# EAGLE design relay-unit (EAGLE 6.5.0)
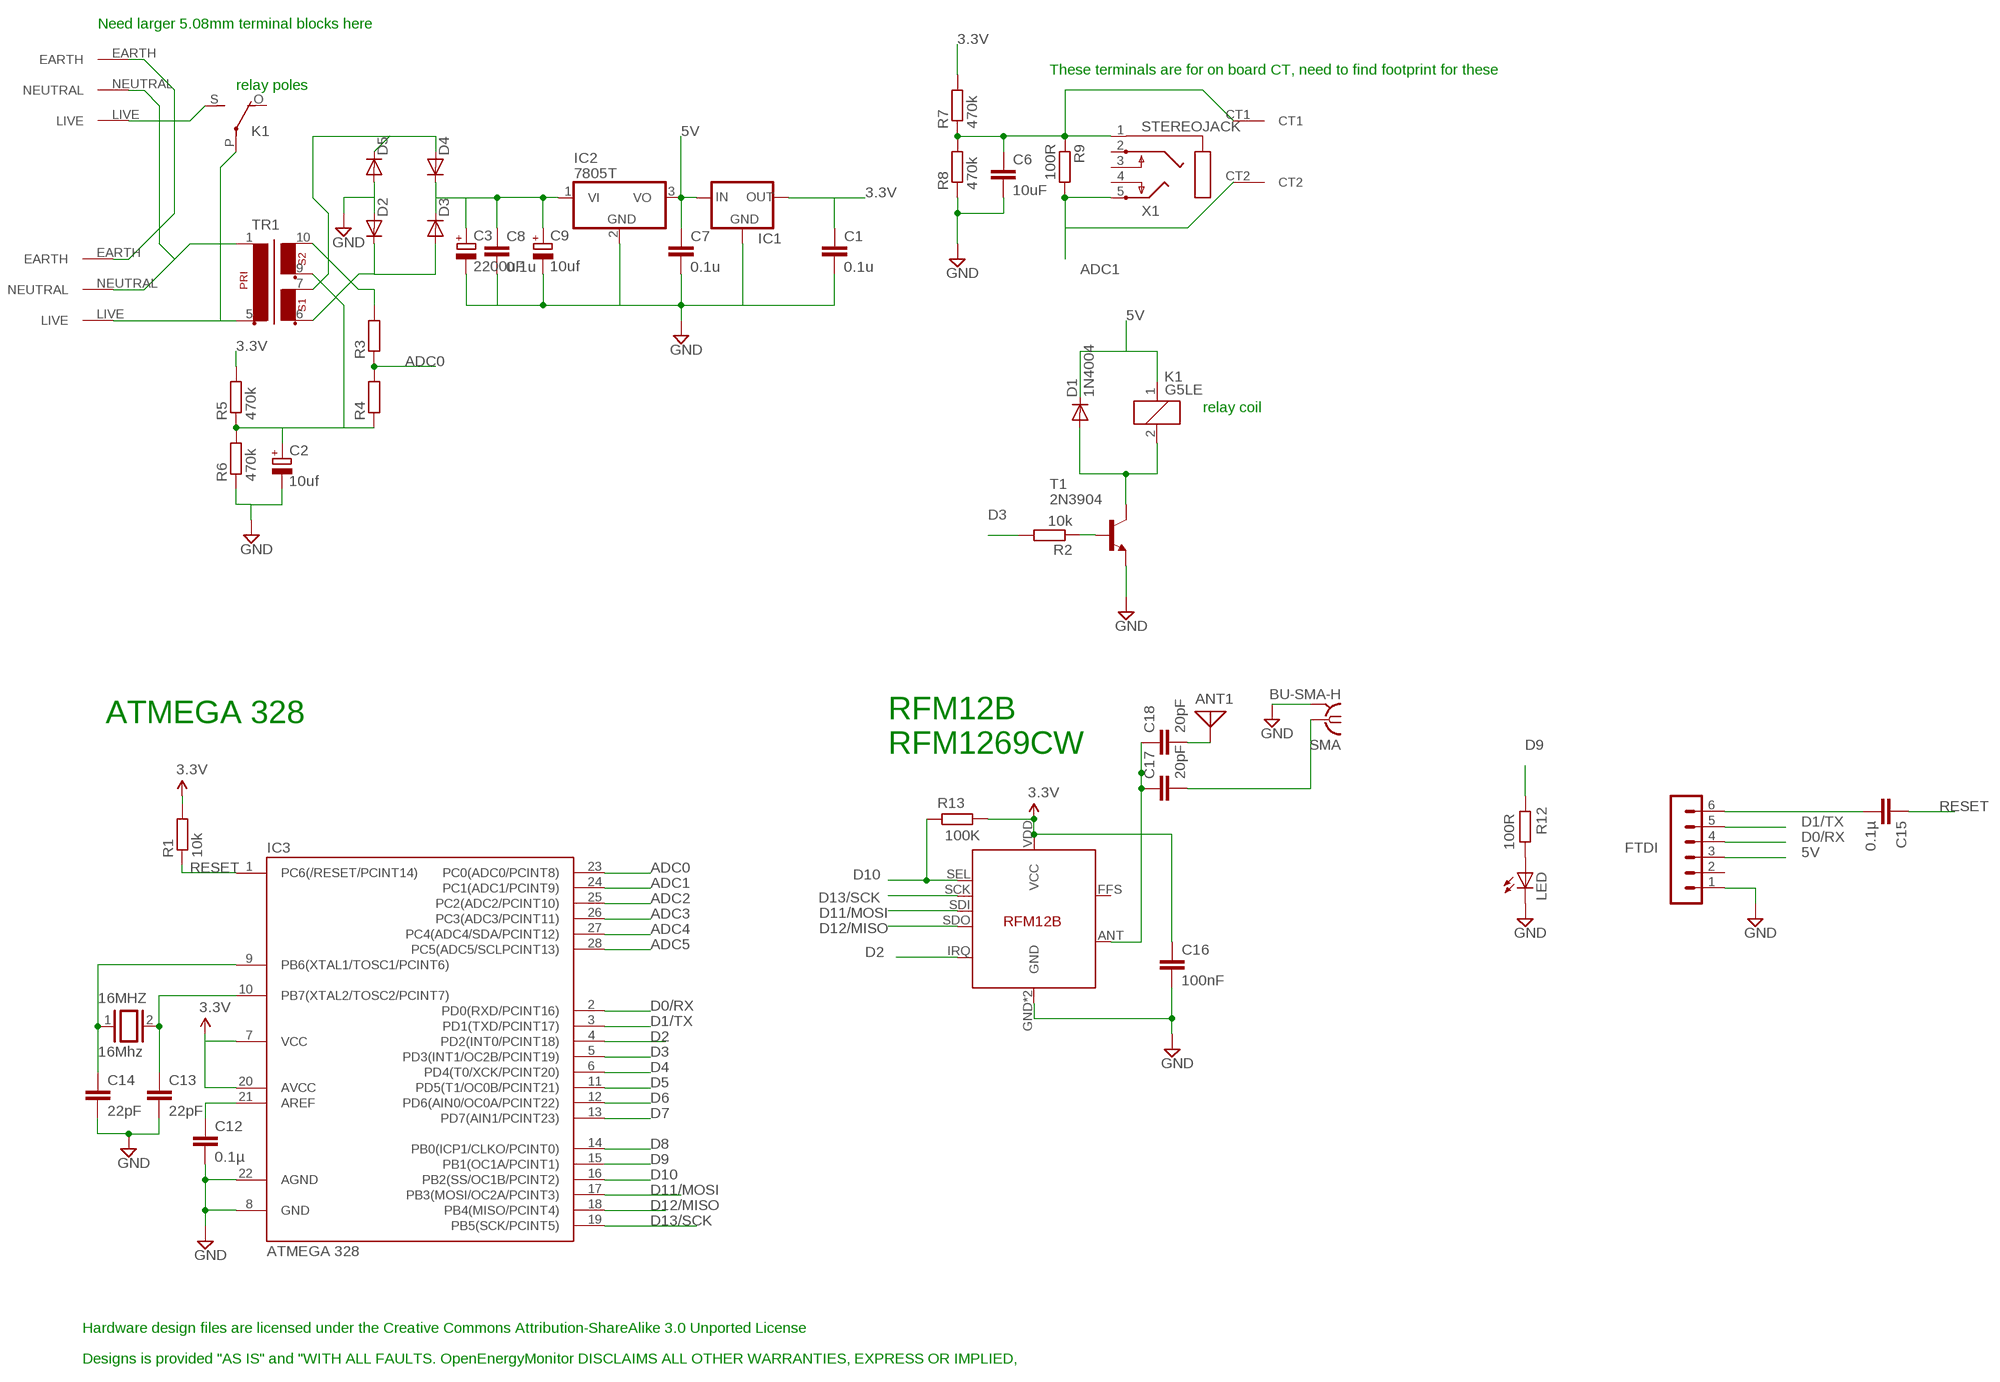
[diagram p0: schematic, sheet 1]

## Parts
16MHZ  16Mhz  XTAL/S  [QS]
ANT1  ANTENNA  [PAD-01]
C1  0.1u  C-EU025-024X044  [C025-024X044]
C2  10uf  CPOL-EUE1.8-4  [E1,8-4]
C3  2200uF  CPOL-EUE5-13  [E5-13]
C6  10uF  C-EU025-024X044  [C025-024X044]
C7  0.1u  C-EU025-024X044  [C025-024X044]
C8  0.1u  C-EU025-024X044  [C025-024X044]
C9  10uf  CPOL-EUE1.8-4  [E1,8-4]
C12  0.1µ  C-EU025-024X044  [C025-024X044]
C13  22pF  C2.5/2  [C2.5-2]
C14  22pF  C2.5/2  [C2.5-2]
C15  0.1µ  C-EU025-024X044  [C025-024X044]
C16  100nF  C-EU025-024X044  [C025-024X044]
C17  20pF  C-EU025-024X044  [C025-024X044]
C18  20pF  C-EU025-024X044  [C025-024X044]
D1  1N4004  [DO41-10]
D2  1N4004  [DO41-10]
D3  1N4004  [DO41-10]
D4  1N4004  [DO41-10]
D5  1N4004  [DO41-10]
FTDI  FTDI  MA06-1  [MA06-1]
IC1  MCP1700TRI  [TO92]
IC2  7805T  [TO220H]
IC3  ATMEGA 328  ATMEGA48/88/168-PU  [DIL28-3]
K1  G5LE  [G5LE]
LED  LED3MM  [LED3MM]
R1  10k  R-EU_0204/7  [0204/7]
R2  10k  R-EU_0204/7  [0204/7]
R3  R-EU_0204/7  [0204/7]
R4  R-EU_0204/7  [0204/7]
R5  470k  R-EU_0204/7  [0204/7]
R6  470k  R-EU_0204/7  [0204/7]
R7  470k  R-EU_0204/7  [0204/7]
R8  470k  R-EU_0204/7  [0204/7]
R9  100R  R-EU_0204/7  [0204/7]
R12  100R  R-EU_0204/7  [0204/7]
R13  100K  R-EU_0204/7  [0204/7]
SMA  BU-SMA-H  [BU-SMA-H]
T1  2N3904  [TO92]
TR1  EI30-2  [EI30-2]
U$1  TESTTEST  [TEST]
U$2  AC_IN  [AC_IN]
U$3  CT  [CT]
U$14  RFM12B  [RFM12B]
X1  STEREOJACK  [STX3100]

## Nets
3.3V: C1.1 C16.1 IC1.3(OUT) IC3.7(VCC) IC3.20(AVCC) R1.2 R5.2 R7.2 R13.1 U$14.VDD(VCC)
5V: C7.1 D1.C FTDI.3 IC1.2(IN) IC2.3(VO) K1.1
ADC0: IC3.23(PC0(ADC0/PCINT8)) R3.1 R4.2
ADC1: IC3.24(PC1(ADC1/PCINT9)) R9.2 U$3.CT2 X1.5
ADC2: IC3.25(PC2(ADC2/PCINT10))
ADC3: IC3.26(PC3(ADC3/PCINT11))
ADC4: IC3.27(PC4(ADC4/SDA/PCINT12))
ADC5: IC3.28(PC5(ADC5/SCLPCINT13))
D0/RX: FTDI.4 IC3.2(PD0(RXD/PCINT16))
D1/TX: FTDI.5 IC3.3(PD1(TXD/PCINT17))
D2: IC3.4(PD2(INT0/PCINT18)) U$14.IRQ
D3: IC3.5(PD3(INT1/OC2B/PCINT19)) R2.2
D4: IC3.6(PD4(T0/XCK/PCINT20))
D5: IC3.11(PD5(T1/OC0B/PCINT21))
D6: IC3.12(PD6(AIN0/OC0A/PCINT22))
D7: IC3.13(PD7(AIN1/PCINT23))
D8: IC3.14(PB0(ICP1/CLKO/PCINT0))
D9: IC3.15(PB1(OC1A/PCINT1)) R12.2
D10: IC3.16(PB2(SS/OC1B/PCINT2)) R13.2 U$14.SEL
D11/MOSI: IC3.17(PB3(MOSI/OC2A/PCINT3)) U$14.SDI
D12/MISO: IC3.18(PB4(MISO/PCINT4)) U$14.SDO
D13/SCK: IC3.19(PB5(SCK/PCINT5)) U$14.SCK
DIG1: C17.1 C18.1 U$14.ANT
GND: C1.2 C2.- C3.- C6.2 C7.2 C8.2 C9.- C12.2 C13.2 C14.2 C16.2 D2.A D5.A FTDI.1 IC1.1(GND) IC2.2(GND) IC3.8(GND) IC3.22(AGND) LED.K(C) R6.1 R8.1 SMA.2 SMA.3 SMA.4 SMA.5 T1.3(E) U$14.GND U$14.P$12(GND)
N$1: C12.1 IC3.21(AREF)
N$2: 16MHZ.2 C13.1 IC3.10(PB7(XTAL2/TOSC2/PCINT7))
N$4: C15.2 FTDI.6
N$8: LED.A R12.1
N$11: ANT1.1 C18.2
N$12: 16MHZ.1 C14.1 IC3.9(PB6(XTAL1/TOSC1/PCINT6))
N$13: C3.+ C8.1 C9.+ D3.C D4.C IC2.1(VI)
N$14: R3.2 TR1.10
N$15: R2.1 T1.2(B)
N$16: D1.A K1.2 T1.1(C)
N$19: K1.S(2:S) U$1.LIVE
N$20: TR1.1 U$1.NEUTRAL U$2.NEUTRAL
N$21: C2.+ R4.1 R5.1 R6.2 TR1.9
N$22: D2.C D3.A TR1.6
N$24: C17.2 SMA.1
N$26: C6.1 R7.1 R8.2 R9.1 U$3.CT1 X1.1
N$28: D4.A D5.C TR1.7
N$36: U$1.EARTH U$2.EARTH
N$40: K1.P(2:P) TR1.5 U$2.LIVE
RESET: C15.1 IC3.1(PC6(/RESET/PCINT14)) R1.1
Unconnected: FTDI.2 K1.O(2:O) U$14.FFS X1.2 X1.3 X1.4

## Notes on the sheet
- Need larger 5.08mm terminal blocks here
- These terminals are for on board CT, need to find footprint for these
- relay poles
- relay coil
- ATMEGA 328
- RFM12B
  RFM1269CW
- Hardware design files are licensed under the Creative Commons Attribution-ShareAlike 3.0 Unported License
- Designs is provided "AS IS" and "WITH ALL FAULTS. OpenEnergyMonitor DISCLAIMS ALL OTHER WARRANTIES, EXPRESS OR IMPLIED,

## Library data of the parts
16MHZ = special:XTAL/S: CRYSTAL
ANT1 = discrete:ANTENNA: Antenna
C1 C6-C8 C12 C15-C18 = resistor:C-EU: CAPACITOR, European symbol
C2 C3 C9 = rcl:CPOL-EU: POLARIZED CAPACITOR, European symbol
C13 C14 = capacitor-wima:C: CAPACITOR naming: grid - package width
D1-D5 = adafruit:1N4004: DIODE General purpose 1N400x type rectifier (With bigger pads) http://www.ladyada.net/library/pcb/eaglelibrary.html
FTDI = JeeLabs:MA06-1: PIN HEADER
IC1 = adafruit:MCP1700: VOLTAGE REGULATOR
IC2 = adafruit:78*: Positive VOLTAGE REGULATOR Added bigger pads to the TO-92 package
IC3 = atmega8:ATMEGA48/88/168-PU
K1 = relay:G5LE: RELAY 1 x switch, 10 A/120 V AC, 8 A/30 V DC, Omron; OC_FARNELL: unknown; OC_NEWARK: unknown
LED = adafruit:LED: LED OSRAM: - CHIPLED LG R971, LG N971, LY N971, LG Q971, LY Q971, LO R971, LY R971 LH N974, LH R974 LS Q976, LO Q976, LY Q976 LO Q996 - Hyper CHIPLED LW Q18S LB Q993, LB Q99A, LB R99A - SideLED LS A670, LO A670, LY A670, LG A670, LP A670 LB A673, LV A673, LT A673, LW A673 LH A674 LY A675 LS A676, LA A676, LO A676, LY A676, LW A676 LS A679, LY A679, LG A679 - Hyper Micro SIDELED® LS Y876, LA Y876, LO Y876, LY Y876 LT Y87S - SmartLED LW L88C, LW L88S LB L89C, LB L89S, LG L890 LS L89K, LO L89K, LY L89K LS L896, LA L896, LO L896, LY L896 - TOPLED LS T670, LO T670, LY T670, LG T670, LP T670 LSG T670, LSP T670, LSY T670, LOP T670, LYG T670 LG T671, LOG T671, LSG T671 LB T673, LV T673, LT T673, LW T673 LH T674 LS T676, LA T676, LO T676, LY T676, LB T676, LH T676, LSB T676, LW T676 LB T67C, LV T67C, LT T67C, LS T67K, LO T67K, LY T67K, LW E67C LS E67B, LA E67B, LO E67B, LY E67B, LB E67C, LV E67C, LT E67C LW T67C LS T679, LY T679, LG T679 LS T770, LO T770, LY T770, LG T770, LP T770 LB T773, LV T773, LT T773, LW T773 LH T774 LS E675, LA E675, LY E675, LS T675 LS T776, LA T776, LO T776, LY T776, LB T776 LHGB T686 LT T68C, LB T68C - Hyper Mini TOPLED® LB M676 - Mini TOPLED Santana® LG M470 LS M47K, LO M47K, LY M47K Source: http://www.osram.convergy.de/
R1 = resistor:R-EU_: RESISTOR, European symbol
R2-R9 R12 R13 = rcl:R-EU_: RESISTOR, European symbol
SMA = con-coax:BU-SMA-H: FEMALE SMA CONNECTOR Radiall; OC_FARNELL: unknown; OC_NEWARK: unknown
T1 = transistor:2N3904: NPN TRANSISTOR
TR1 = trafo:EI30-2: TRANSFORMER 1 primary winding, 2 secondary windings ERA
U$1 = trystan:TEST
U$2 = trystan:AC_IN
U$3 = trystan:CT
U$14 = JeeParts:RFM12B
X1 = adafruit:STEREOJACK: MIC/HEADPHONE JACK Stereo jack with two switches. Kycon STX3100, CUI SJ1-3555NG and/or 4UCon 05544

## Net classes
0 default: width 0.203 mm, drill 0.6 mm, clearance 0.203 mm
1 power: width 0.381 mm, drill 0.6 mm, clearance 0.254 mm

## Board
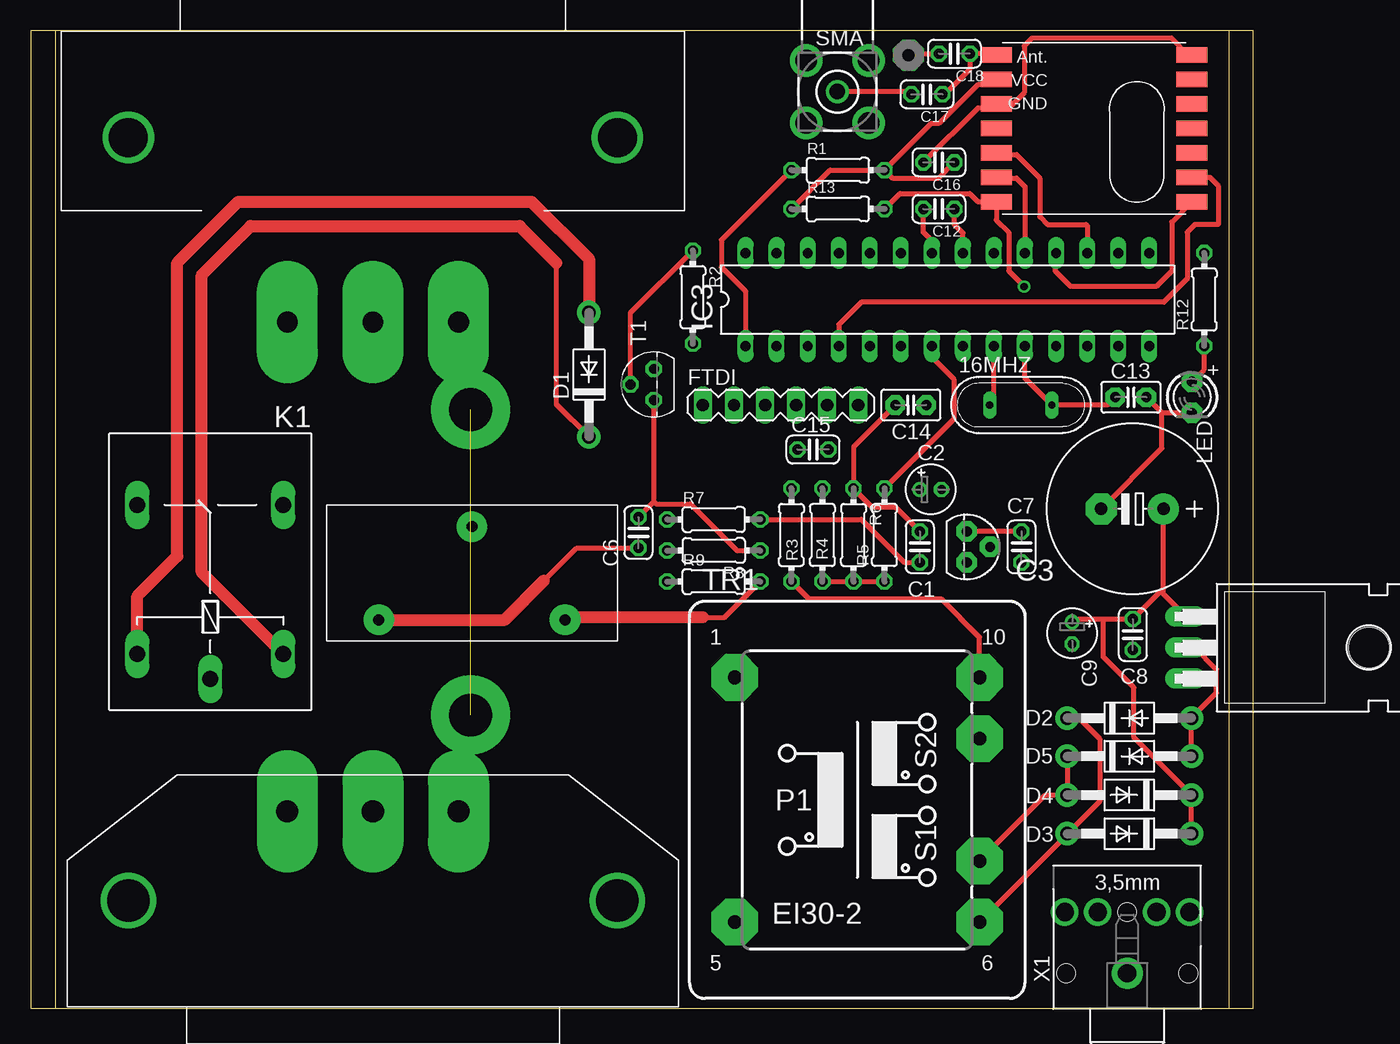
[diagram p1: board, top side]
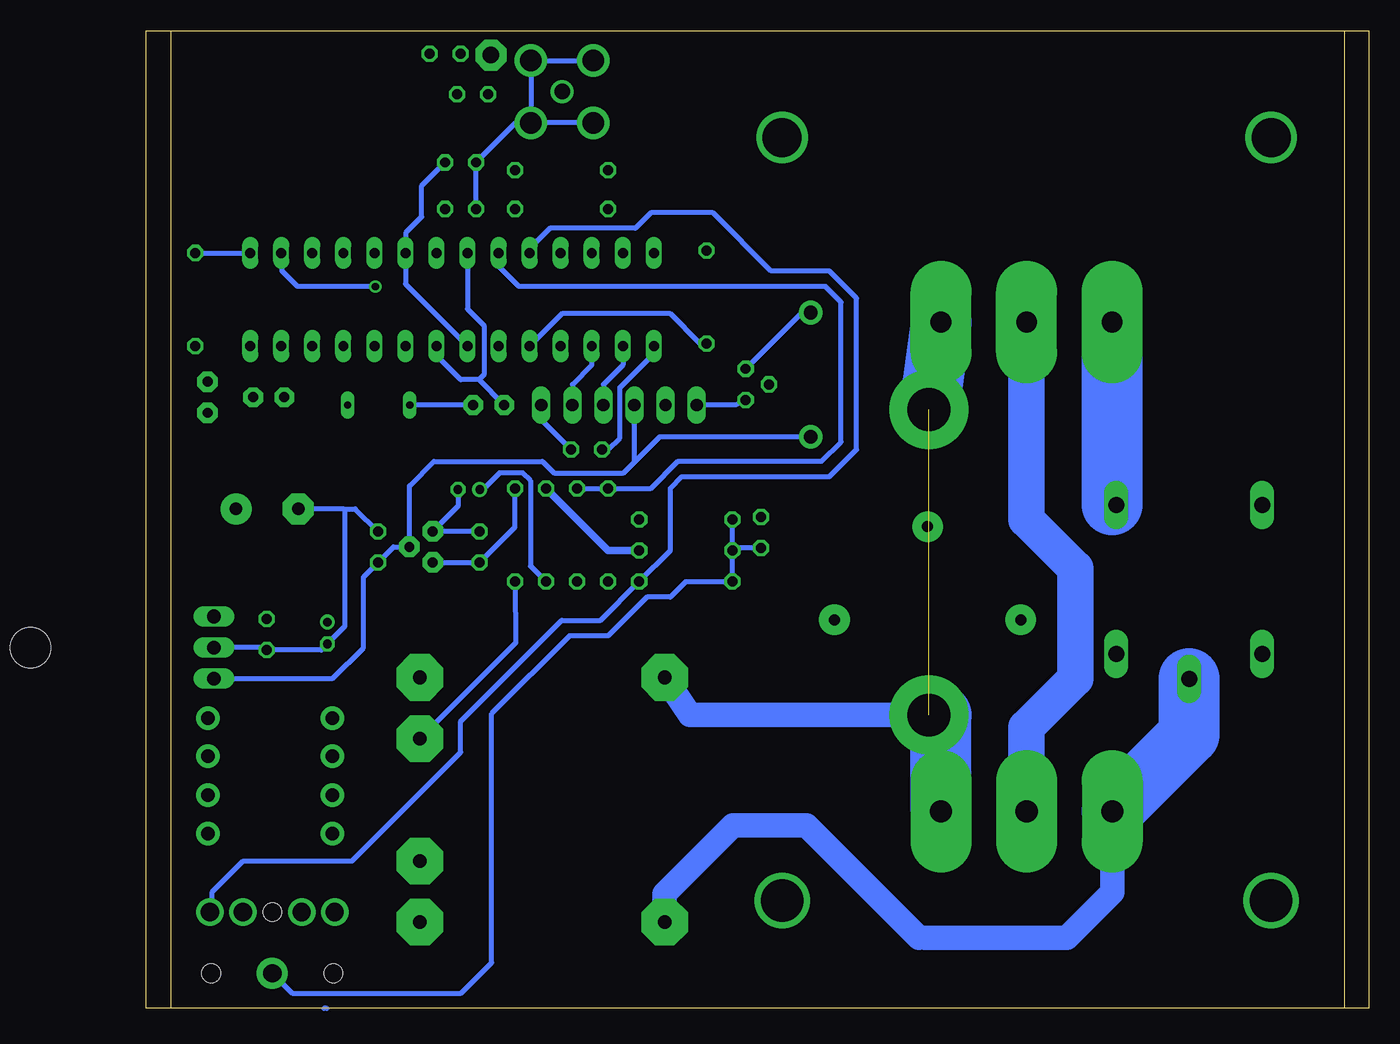
[diagram p2: board, bottom side, seen from below]

Size 100 x 80 mm. Coordinates in mm from the lower left corner, seen from the top.
Outline: 2,0 0,0 0,80 2,80
Outline: 2,0 98,0
Outline: 98,0 100,0 100,80 98,80
Outline: 98,80 2,80
Outline: 2,80 2,0
Outline: 98,80 98,0
Copper layers (1*16): Top 0.035mm / dielectric 1.5mm / Bottom 0.035mm
Design rules "default": minimum track width 10mil, minimum drill 24mil, track to track 8mil, track to pad 8mil, pad to pad 8mil, via to via 8mil, smd to smd 8mil, copper to edge 40mil, drill to drill 8mil, minimum pad ring 10mil, minimum via ring 8mil, stop-mask expansion 4mil, vias tented up to drill 0mil, thermal gap 10mil

### Footprints (pad centres in the part's own frame; a part is rotated, then mirrored left to right if it is on the bottom)
QS = drill 0.61 long: 1 -2.54,0; 2 2.54,0
PAD-01 = drill 1.321 pad 2.54 octagon: 1 0,0
C025-024X044 = drill 0.813 octagon: 1 -1.27,0; 2 1.27,0
E1,8-4 = drill 0.711 pad 1.168: + -0.889,0 | drill 0.711 pad 1.168 octagon: - 0.889,0
E5-13 = drill 1.016 pad 2.54: + -2.54,0 | drill 1.016 pad 2.54 octagon: - 2.54,0
C2.5-2 = drill 0.813 pad 1.6 octagon: 1 -1.27,0; 2 1.27,0
DO41-10 = drill 1.118 pad 1.93: A 5.08,0; C -5.08,0
MA06-1 = drill 1.016 long: 1 0,0; 2 2.54,0; 3 5.08,0; 4 7.62,0; 5 10.16,0; 6 12.7,0
TO92 = drill 0.813 pad 1.676 octagon: 1 -1.27,0; 2 0,1.905; 3 1.27,0
TO220H = drill 1.118 long: 1 -2.54,-10.16; 2 0,-10.16; 3 2.54,-10.16 | hole 3.302: 0,4.826
DIL28-3 = drill 0.813 long: 1 -16.51,-3.81; 2 -13.97,-3.81; 3 -11.43,-3.81; 4 -8.89,-3.81; 5 -6.35,-3.81; 6 -3.81,-3.81; 7 -1.27,-3.81; 8 1.27,-3.81; 9 3.81,-3.81; 10 6.35,-3.81; 11 8.89,-3.81; 12 11.43,-3.81; 13 13.97,-3.81; 14 16.51,-3.81; 15 16.51,3.81; 16 13.97,3.81; 17 11.43,3.81; 18 8.89,3.81; 19 6.35,3.81; 20 3.81,3.81; 21 1.27,3.81; 22 -1.27,3.81; 23 -3.81,3.81; 24 -6.35,3.81; 25 -8.89,3.81; 26 -11.43,3.81; 27 -13.97,3.81; 28 -16.51,3.81
G5LE = drill 1.321 long: 1 -7.493,-5.969; 2 -7.493,5.969; O 4.699,5.969; P -9.525,0; S 4.699,-5.969
LED3MM = drill 0.813 pad 1.676 octagon: A -1.27,0; K 1.27,0
0204/7 = drill 0.813 octagon: 1 -3.81,0; 2 3.81,0
BU-SMA-H = drill 1.27: 1 0,0 | drill 1.778: 2 -2.55,2.55; 3 2.55,2.55; 4 2.55,-2.55; 5 -2.55,-2.55
TO92' = drill 0.813 octagon: 1 1.27,0; 2 0,1.905; 3 -1.27,0
EI30-2 = drill 1.118 pad 3.81 octagon: 1 -10.008,10.008; 5 -10.008,-10.008; 6 10.008,-10.008; 7 10.008,-5.004; 9 10.008,5.004; 10 10.008,10.008
TEST = drill 1.7 pad 5 long: EARTH 0,-15.1; LIVE -7,-15.1; NEUTRAL 7,-15.1 | drill 1.7 pad 3.5 octagon: LIVE1 -7,-15.1 | drill 3.2: P$4 -20,0; P$5 20,0
AC_IN = drill 1.8 pad 5 long: EARTH 0,0; LIVE 7,0; NEUTRAL -7,0 | drill 3.5: P$4 20,7.3; P$5 -20,7.3
CT = drill 0.9 pad 2.5: CT1 7.62,0; CT2 -7.62,0; P$3 0,-7.62
RFM12B = smd 2.54 x 1.27: ANT 8,-6; FFS -8,2; GND 8,-2; IRQ -8,4; P$8 -8,0; P$9 -8,-2; P$10 -8,-4; P$12 -8,-6; P$16 8,0; SCK 8,4; SDI 8,2; SDO -8,6; SEL 8,6; VDD 8,-4
STX3100 = drill 1.5 pad 2.54: 1 2.7,-0.1 | drill 1.5: 2 7.7,5; 3 7.7,2.3; 4 7.7,-2.5; 5 7.7,-5.2 | hole 1.5: 2.7,4.9; 2.7,-5.1; 7.7,-0.1

### Placement (x,y rotation side)
16MHZ  81,49.37 0 top
ANT1  71.83,78 0 top
C1  72.75,37.76 90 top
C2  73.62,42.46 0 top
C3  90.12,40.88 180 top
C6  49.73,38.94 90 top
C7  81.06,37.76 90 top
C8  90.16,30.59 270 top
C9  85.2,30.71 270 top
C12  74.3,65.41 180 top
C13  90,50 0 top
C14  72,49.37 180 top
C15  64,45.73 0 top
C16  74.3,69.22 180 top
C17  73.32,74.78 180 top
C18  75.56,78.11 180 top
D1  45.67,51.85 90 top
D2  89.88,23.75 0 top
D3  89.88,14.29 180 top
D4  89.88,17.46 180 top
D5  89.88,20.63 0 top
FTDI  55,49.37 0 top
IC1  76.58,37.76 270 top
IC2  104.65,29.52 270 top
IC3  75,58 0 top
K1  14.71,36.49 90 top
LED  95,50 270 top
R1  66.04,68.58 0 top
R2  54.17,58.2 270 top
R3  62.23,38.73 270 top
R4  64.77,38.73 90 top
R5  69.85,38.73 90 top
R6  67.31,38.73 270 top
R7  55.88,40.01 0 top
R8  55.88,37.47 180 top
R9  55.88,34.92 0 top
R12  96,58 90 top
R13  66.04,65.41 0 top
SMA  66,75 90 top
T1  2N3904  [TO92']  50.98,51.05 90 top
TR1  67.62,17.07 0 top
U$1  28,71.25 0 top
U$2  28,16.12 180 top
U$3  36.1,31.8 180 top
U$14  87,72 180 top
X1  89.6,0.18 90 top

### Tracks (layer width: path | path; a pad name or v marks a point on that pad's centre or on a via)
3.3V
  Top 0.406: R13.1 65.41,68.58 R1.2 | R1.2 70.48,67.94 74.3,67.94 C16.1 | U$14.VDD 78.56,75.56 77.47,75.56 74.3,72.39 73.66,72.39 R1.2 | R7.2 67.94,40.01 71.47,36.48 C1.1 | R5.2 75.56,48.26 75.56,51.44 73.73,53.27 IC3.7
  Bottom 0.406: IC1.3 C1.1 69.85,39.38 R5.2 | C16.1 77.47,67.31 77.47,64.77 78.74,63.5 78.74,61.88 IC3.20 78.81,59.27 IC3.7
5V
  Top 0.406: 43,61 43,49.45 D1.C
  Top 1: K1.1 14,35.67 14,60 18,64 40,64 43,61
  Bottom 0.406: IC2.3 94.47,27 84.75,27 82.25,29.5 82.25,35.3 C7.1 79.79,37.76 IC1.2 78.49,42.76 76.5,44.75 67.61,44.75 66.67,43.81 60.96,43.81 60.08,44.7 | 60.08,44.7 FTDI.3 | 60.08,44.7 58.01,46.77 D1.C
ADC0
  Bottom 0.406: R4.2 R3.1 58.74,42.55 56.52,44.77 44.77,44.77 43.18,46.35 43.18,57.78 44.45,59.05 69.53,59.05 71.19,60.71 IC3.23
ADC1
  Top 0.406: 43.92,32 U$3.CT2 | 55,32 56.77,32 R9.2
  Top 1: 55,32 43.92,32
  Bottom 0.406: X1.5 94.61,8.06 94.61,9.53 92.08,12.06 83.19,12.06 74.3,20.95 74.3,23.5 66.04,31.75 62.87,31.75 R9.2 57.15,37.47 57.15,42.55 56.2,43.5 44.13,43.5 41.91,45.72 41.91,58.1 44.13,60.33 48.9,60.33 53.66,65.09 58.74,65.09 60.01,63.82 66.99,63.82 68.65,62.16 IC3.24
D0/RX
  Bottom 0.406: IC3.2 61.03,52.63 62.62,51.05 FTDI.4
D1/TX
  Bottom 0.406: IC3.3 63.57,52.63 65.16,51.05 FTDI.5
D2
  Top 0.406: U$14.IRQ 96.47,68 97.16,67.31 97.16,64.14 95.25,64.14 94.61,63.5 94.61,59.69 92.71,57.78 67.94,57.78 66.11,55.95 IC3.4
D3
  Bottom 0.406: R2.2 54.7,54.39 57.15,56.83 66.01,56.83 IC3.5
D9
  Bottom 0.406: R12.2 IC3.15
D10  (via drill 0.6)
  Top 0.406: R13.2 71.12,66.67 76.83,66.67 77.51,66 U$14.SEL 79,64.51 80.01,63.5 80.01,60.33 v81.28,59.05
  Bottom 0.406: v81.28,59.05 87.63,59.05 88.9,60.33 88.9,61.74 IC3.16
D11/MOSI
  Top 0.406: U$14.SDI 79.15,69.85 80.64,69.85 82.55,67.94 82.55,64.77 83.19,64.14 86.36,64.14 86.43,64.06 IC3.17
D12/MISO
  Top 0.406: U$14.SDO 93.34,64.34 93.34,60.33 92.08,59.05 85.09,59.05 83.82,60.33 83.82,61.74 IC3.18
D13/SCK
  Top 0.406: U$14.SCK 79.06,67.94 80.64,67.94 81.35,67.24 IC3.19
DIG1
  Top 0.406: U$14.ANT 78,78 77.89,78.11 C18.1 76.83,76.83 74.78,74.78 C17.1
GND
  Top 0.406: D5.A D2.A 97,25.8 97,27.75 95.22,29.52 IC2.2 | C1.2 70.77,41 68.86,41 R6.1 67.31,45.95 C14.2 | IC3.22 73.73,62.8 73.03,63.5 C12.2 | U$14.P$12 94.72,78 93.34,79.38 81.92,79.38 81.28,78.74 81.28,74.93 80.01,73.66 79.34,73.66 U$14.GND 78.66,73.66 77.47,73.66 C16.2 | C13.2 92.54,48.73 | 92.54,48.73 LED.K | C3.- 92.54,45.83 92.54,48.73 | C6.2 50.98,41.46 | 50.98,41.46 T1.3 | 50.98,41.46 51.16,41.27 53.98,41.27 57.78,37.47 R8.1 | C7.2 IC1.1
  Bottom 0.406: IC2.2 90.36,29.52 C8.2 85.71,29.32 C9.- 83.75,31.28 83.75,40.75 83.88,40.88 | C1.2 IC1.1 | C2.- 74.51,41.1 IC1.1 | T1.3 51.83,49.37 FTDI.1 | 76.58,39.12 IC1.1 | C12.2 C16.2 69.79,72.45 SMA.5 | SMA.5 SMA.4 SMA.3 | SMA.2 SMA.5 | 83.88,40.88 C3.- | 83.88,40.88 82.91,40.88 C7.2 | C14.2 72.8,51.44 | 72.8,51.44 74.3,51.44 76.27,53.41 IC3.8 76.2,54.26 | IC3.22 73.73,57.22 72.39,55.88 72.39,51.84 72.8,51.44
  Bottom 0.61: R6.1 62.23,37.47 R8.1
N$1
  Top 0.406: IC3.21 76.27,63.43 75.56,64.14 C12.1
N$2
  Top 0.406: IC3.10 81.35,51.55 16MHZ.2 88.09,49.37 C13.1
N$4
  Bottom 0.406: C15.2 67.7,48.16 FTDI.6
N$8
  Top 0.406: LED.A 96,52.27 R12.1
N$11
  Top 0.406: ANT1.1 71.93,78.11 C18.2
N$12
  Top 0.406: 16MHZ.1 78.81,49.72 IC3.9
  Bottom 0.406: C14.1 16MHZ.1
N$13
  Top 0.406: D3.C D4.C 90.25,22.16 90.25,26.25 87.75,28.75 87.75,31.75 87.86,31.86 | IC2.1 92.67,33.89 92.67,34.37 | 92.67,34.37 C3.+ | C8.1 92.67,34.37 | 87.86,31.86 88,31.86 C8.1 | C8.1 90.02,32 90,32 | C9.+ 85.46,31.86 87.86,31.86
N$14
  Top 0.406: TR1.10 77.63,30.37 74.5,33.5 63.66,33.5 R3.2
N$15
  Top 0.406: T1.2 49.08,56.91 R2.1
N$16
  Top 1: K1.2 8.74,33.74 12,37 12,61 17,66 41,66 45.67,61.33 D1.A
  Bottom 0.406: T1.1 46.38,56.93 D1.A
N$19
  Bottom 0.406: K1.S 21,41.19
  Bottom 5: 21,41.19 U$1.LIVE
N$20  (1 unrouted)
  Bottom 2: 36,24 55.53,24 TR1.1
  Bottom 5: U$2.NEUTRAL 35,24 36,24 | U$1.NEUTRAL 36,49
N$21
  Top 0.406: R4.1 R6.2 R5.1
  Bottom 0.406: R5.1 69.8,29.91 TR1.9 | R6.2 68.58,36.2 68.58,43.18 69.22,43.81 71.12,43.81 72.47,42.46 C2.+
N$22
  Top 0.406: TR1.6 84.8,14.23 D3.A 87.5,17 87.5,22 85.75,23.75 D2.C
N$24
  Top 0.406: C17.2 71.83,75 SMA.1
N$26
  Top 0.406: 42,35 44.66,37.66 C6.1
  Top 1: U$3.CT1 38.8,31.8 42,35
  Bottom 0.406: X1.1 88.07,1.25 74.25,1.25 71.75,3.75 71.75,24.14 65.41,30.48 62.23,30.48 59.05,33.66 57.15,33.66 55.88,34.92 R9.1 R8.2 | R8.2 R7.1 | C6.1 51.87,37.66 R8.2
N$28
  Top 0.406: TR1.7 83.02,17.46 D4.A D5.C
N$30
  Bottom 0.406: 85.25,0 85.5,0
N$32  (via drill 3.5 pad 6.45)
  other vias: 36,24
N$33  (via drill 3.5 pad 6.45)
  other vias: 36,49
N$36
  Bottom 3: U$1.EARTH 28,40 24,36 24,27 28,23 U$2.EARTH
N$40
  Bottom 0.406: 36.34,5.8 36.8,5.8
  Bottom 2: U$2.LIVE 21,9.5 24.7,5.8 36.34,5.8 | 36.8,5.8 46,15 52,15 57.61,9.39 TR1.5
  Bottom 5: U$2.LIVE 14.71,22.42 K1.P
RESET
  Top 0.406: R1.1 56.52,62.87 56.52,60.64 58.49,58.67 IC3.1
  Bottom 0.406: C15.1 62.23,45.72 61.28,46.67 61.28,50.8 58.49,53.59 IC3.1